# Altium schematic sheet Functional_Module_main.SchDoc: =GlobalProjectName
size 209 x 297 mm; ApprovedBy: Утвердил; CheckedBy: Проверил; Author: Разработал; SheetNumber: 8; SheetTotal: 9; PageSetup: Record=PageOptions|CenterHorizontal=True|CenterVertical=True|PrintScale=1.00|XCorrection=1.00|YCorrection=1.00|PrintKind=1|BorderSize=5000000|LeftOffset=0|BottomOffset=0|Orientation=2|PaperLength=1000|PaperWidth=1000|Scale=100|PaperSource=15|PrintQuality=1200|MediaType=1|DitherType=10|PaperKind=A3|PrintScaleMode=1; Weight: -; ScaleFactor: -; NormInspection: Норм.Контр.
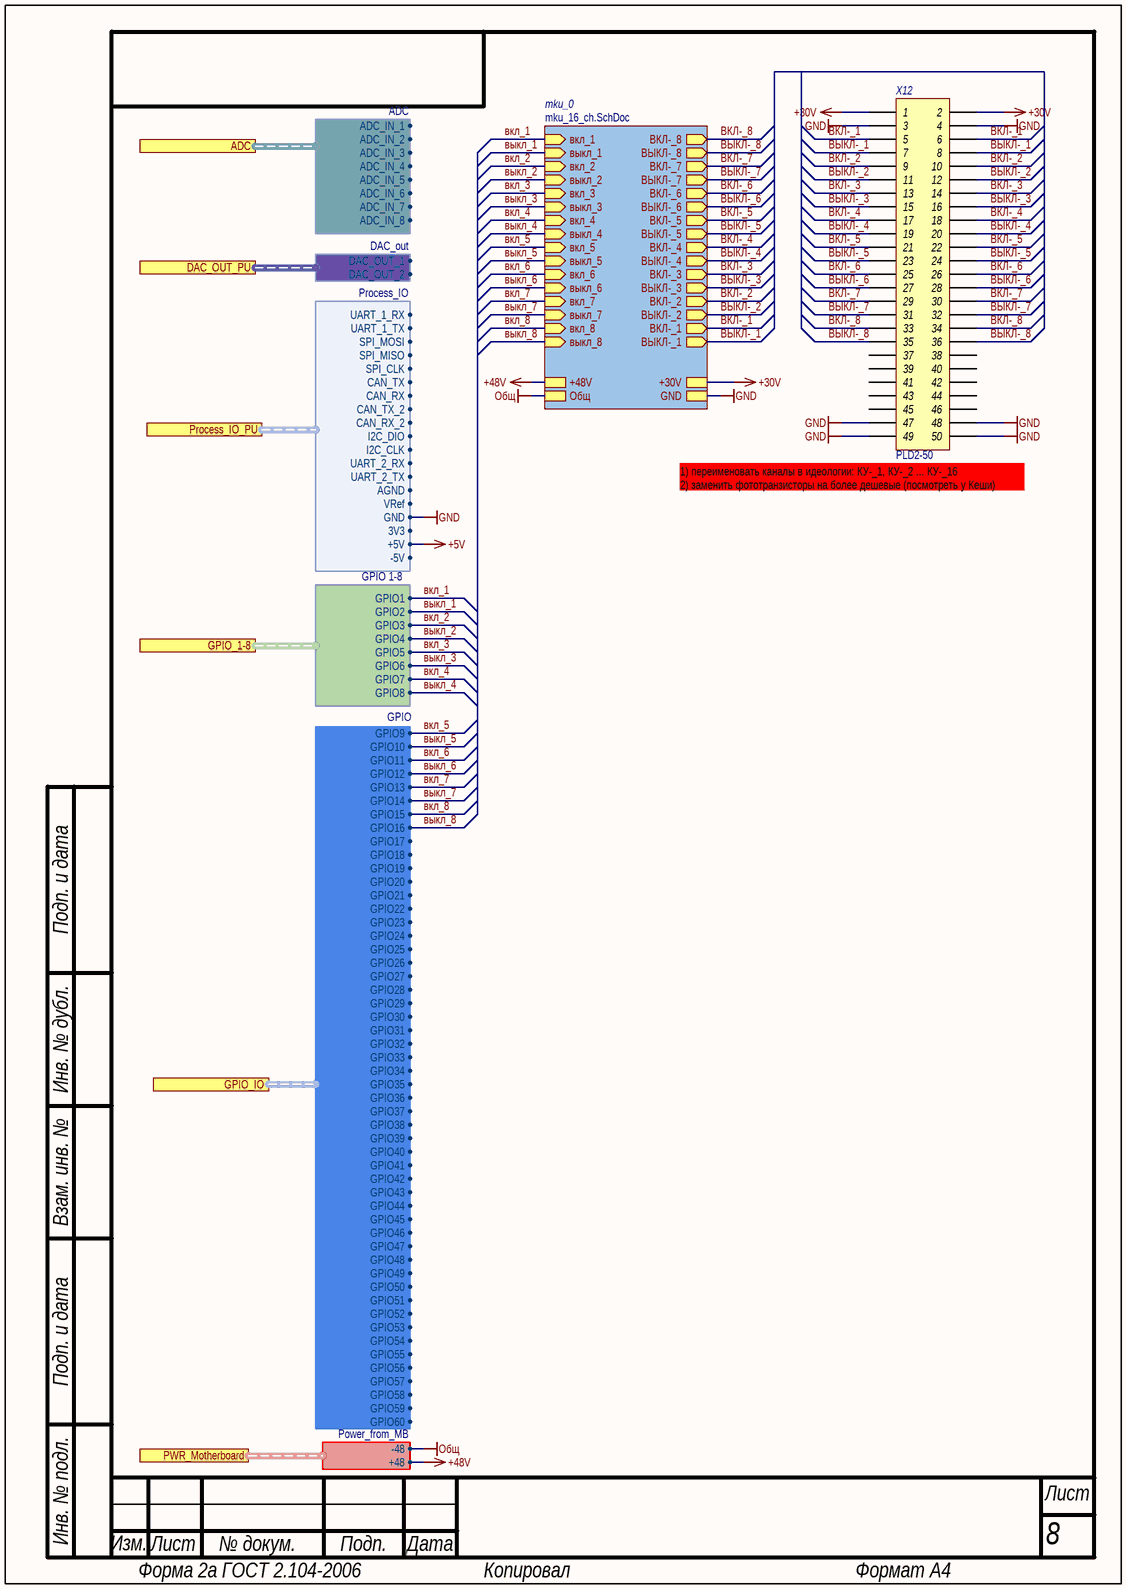
[diagram p0: Functional_Module_main.SchDoc]

## Parts
X12  Header 2X25  [PLD2-50]  (value not drawn)

## Sub-sheets
mku_0 = mku_16_ch.SchDoc: Общ, GND, вкл_2 (in), вкл_4 (in), вкл_3 (in), выкл_1 (in), выкл_5 (in), выкл_8 (in), вкл_7 (in), ВЫКЛ-_1 (out), вкл_1 (in), ВКЛ-_1 (out), выкл_7 (in), выкл_6 (in), выкл_2 (in), вкл_5 (in), вкл_6 (in), выкл_3 (in), вкл_8 (in), выкл_4 (in), ВЫКЛ-_2 (out), ВКЛ-_2 (out), ВЫКЛ-_3 (out), ВКЛ-_3 (out), ВЫКЛ-_4 (out), ВКЛ-_4 (out), ВЫКЛ-_5 (out), ВКЛ-_5 (out), ВЫКЛ-_6 (out), ВКЛ-_6 (out), ВЫКЛ-_7 (out), ВКЛ-_7 (out), ВЫКЛ-_8 (out), ВКЛ-_8 (out), +48V, +30V

## Ports
ADC (harness ADC), DAC_OUT_PU (harness DAC_out), GPIO_1-8 (harness GPIO 1-8), GPIO_IO (harness GPIO), Process_IO_PU (harness Process_IO), PWR_Motherboard (harness Power_from_MB)

## Harnesses
Process_IO: UART_1_RX, UART_1_TX, SPI_MOSI, SPI_MISO, SPI_CLK, CAN_TX, CAN_RX, I2C_DIO, I2C_CLK, UART_2_RX, UART_2_TX, AGND, VRef, GND, 3V3, +5V, -5V, CAN_TX_2, CAN_RX_2
DAC_out: DAC_OUT_1, DAC_OUT_2
GPIO 1-8: GPIO1, GPIO2, GPIO3, GPIO4, GPIO5, GPIO6, GPIO7, GPIO8
Power_from_MB: -48, +48
ADC: ADC_IN_1, ADC_IN_3, ADC_IN_7, ADC_IN_5, ADC_IN_2, ADC_IN_4, ADC_IN_6, ADC_IN_8
GPIO: GPIO9, GPIO10, GPIO11, GPIO12, GPIO13, GPIO14, GPIO15, GPIO16, GPIO17, GPIO18, GPIO19, GPIO20, GPIO21, GPIO22, GPIO23, GPIO24, GPIO25, GPIO26, GPIO27, GPIO28, GPIO29, GPIO30, GPIO31, GPIO32, GPIO33, GPIO34, GPIO35, GPIO36, GPIO37, GPIO38, GPIO39, GPIO40, GPIO41, GPIO42, GPIO43, GPIO44, GPIO45, GPIO46, GPIO47, GPIO48, GPIO49, GPIO50, GPIO51, GPIO52, GPIO53, GPIO54, GPIO55, GPIO56, GPIO57, GPIO58, GPIO59, GPIO60

## Nets
+5V: port Process_IO_PU.+5V
+30V: X12.1 X12.2 ; sheet mku_0/+30V
+48V: sheet mku_0/+48V, port PWR_Motherboard.+48
GND: X12.3 X12.4 X12.47 X12.48 X12.49 X12.50 ; sheet mku_0/GND, port Process_IO_PU.GND
Общ: sheet mku_0/Общ, port PWR_Motherboard.-48
ВКЛ-_1: X12.5 X12.6 ; sheet mku_0/ВКЛ-_1
ВКЛ-_2: X12.9 X12.10 ; sheet mku_0/ВКЛ-_2
ВКЛ-_3: X12.13 X12.14 ; sheet mku_0/ВКЛ-_3
ВКЛ-_4: X12.17 X12.18 ; sheet mku_0/ВКЛ-_4
ВКЛ-_5: X12.21 X12.22 ; sheet mku_0/ВКЛ-_5
ВКЛ-_6: X12.25 X12.26 ; sheet mku_0/ВКЛ-_6
ВКЛ-_7: X12.29 X12.30 ; sheet mku_0/ВКЛ-_7
ВКЛ-_8: X12.33 X12.34 ; sheet mku_0/ВКЛ-_8
вкл_1: sheet mku_0/вкл_1, port GPIO_1-8.GPIO1
вкл_2: sheet mku_0/вкл_2, port GPIO_1-8.GPIO3
вкл_3: sheet mku_0/вкл_3, port GPIO_1-8.GPIO5
вкл_4: sheet mku_0/вкл_4, port GPIO_1-8.GPIO7
вкл_5: sheet mku_0/вкл_5, port GPIO_IO.GPIO9
вкл_6: sheet mku_0/вкл_6, port GPIO_IO.GPIO11
вкл_7: sheet mku_0/вкл_7, port GPIO_IO.GPIO13
вкл_8: sheet mku_0/вкл_8, port GPIO_IO.GPIO15
ВЫКЛ-_1: X12.7 X12.8 ; sheet mku_0/ВЫКЛ-_1
ВЫКЛ-_2: X12.11 X12.12 ; sheet mku_0/ВЫКЛ-_2
ВЫКЛ-_3: X12.15 X12.16 ; sheet mku_0/ВЫКЛ-_3
ВЫКЛ-_4: X12.19 X12.20 ; sheet mku_0/ВЫКЛ-_4
ВЫКЛ-_5: X12.23 X12.24 ; sheet mku_0/ВЫКЛ-_5
ВЫКЛ-_6: X12.27 X12.28 ; sheet mku_0/ВЫКЛ-_6
ВЫКЛ-_7: X12.31 X12.32 ; sheet mku_0/ВЫКЛ-_7
ВЫКЛ-_8: X12.35 X12.36 ; sheet mku_0/ВЫКЛ-_8
выкл_1: sheet mku_0/выкл_1, port GPIO_1-8.GPIO2
выкл_2: sheet mku_0/выкл_2, port GPIO_1-8.GPIO4
выкл_3: sheet mku_0/выкл_3, port GPIO_1-8.GPIO6
выкл_4: sheet mku_0/выкл_4, port GPIO_1-8.GPIO8
выкл_5: sheet mku_0/выкл_5, port GPIO_IO.GPIO10
выкл_6: sheet mku_0/выкл_6, port GPIO_IO.GPIO12
выкл_7: sheet mku_0/выкл_7, port GPIO_IO.GPIO14
выкл_8: sheet mku_0/выкл_8, port GPIO_IO.GPIO16

Not connected (* = marked no-connect by the designer): X12 37 38 39 40 41 42 43 44 45 46

## Notes on the sheet
- (near X12) 1) переименовать каналы в идеологии: КУ-_1, КУ-_2 ... КУ-_16
  2) заменить фототранзисторы на более дешевые (посмотреть у Кеши)
- Подп. и дата
- Инв. № дубл.
- Взам. инв. №
- Инв. № подл.
- Изм.
- Лист
- № докум.
- Подп.
- Дата
- Форма 2а ГОСТ 2.104-2006
- Копировал
- Формат А4

## Library data of the parts
X12 = PLD2-50: Header, 50-Pin, Dual row; Назначение: Header, 20-Pin, Dual row; Потребление, Вт: 0,0; Наименование: PLD2-50